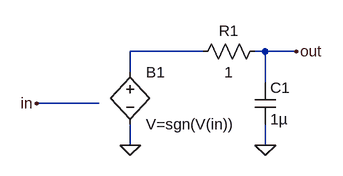
[diagram p0: schematic sgn.asc]
sgn.asc, the LTspice schematic file:
Version 4
SHEET 1 880 680
WIRE 448 48 336 48
WIRE 544 48 528 48
WIRE 592 48 544 48
WIRE 336 80 336 48
WIRE 544 96 544 48
WIRE 288 128 192 128
WIRE 336 192 336 160
WIRE 544 192 544 160
FLAG 192 128 in
FLAG 592 48 out
FLAG 336 192 0
FLAG 544 192 0
SYMBOL bv 336 64 R0
SYMATTR InstName B1
SYMATTR Value V=sgn(V(in))
SYMBOL res 544 32 R90
WINDOW 0 0 56 VBottom 2
WINDOW 3 32 56 VTop 2
SYMATTR InstName R1
SYMATTR Value 1
SYMBOL cap 528 96 R0
SYMATTR InstName C1
SYMATTR Value 1µ

The netlist it stands for:
* sgn.asc
B1 N001 0 V=sgn(V(in))
R1 out N001 1
C1 out 0 1µ
.backanno
.end